# Altium schematic sheet Sheet1.SchDoc
size A4
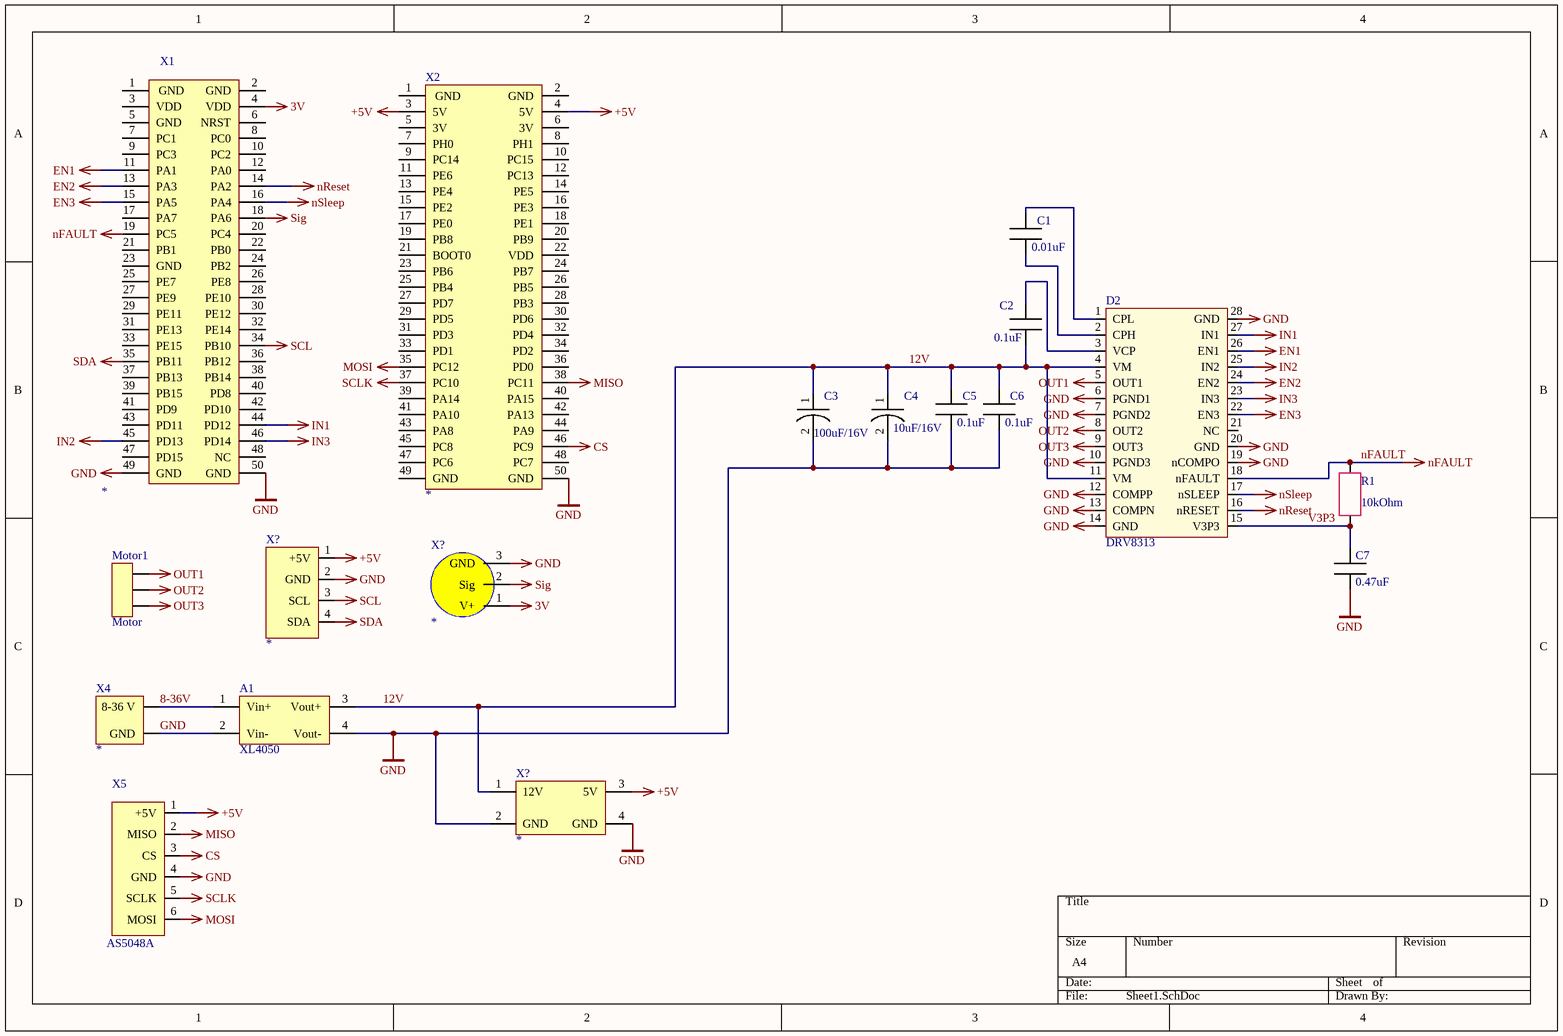
[diagram p0: Sheet1.SchDoc]

## Parts
(Parts that share a designator on the sheet are numbered #1, #2 ... from top to bottom, then left to right.)
A1  XL4050  [XL4050_PCB]
C1  0.01uF  [Ceramic 1206 - duplicate]
C2  0.1uF  [Ceramic 1206 - duplicate]
C3  100uF/16V  [CAP 50-35 5х11]
C4  10uF/16V  [CAP 50-35 5х11]
C5  0.1uF  [Ceramic 1206 - duplicate]
C6  0.1uF  [Ceramic 1206 - duplicate]
C7  0.47uF  [Ceramic 1206 - duplicate]
D2  DRV8313  [DRV8313 board]
Motor1  Motor  [Fhase out]
R1  10kOhm  [Resistor 1206]
X1  *  [STM32F4Discovery_P]
X2  *  [STM32F4Discovery_P]
X4  *  [Power input]
X5  AS5048A  [AS5048A_input]
X?#1  *  [Potentiometr]
X?#2  *  [I2C input]
X?#3  *  [LM2596S_PCB]

## Nets
3V: X1.4(VDD) X?#1.1(V+)
+5V: X2.3(5V) X2.4(5V) X5.1(+5V) X?#2.1(+5V) X?#3.3(5V)
CS: X2.46(PC9) X5.3(CS)
EN1: D2.26(EN1) X1.11(PA1)
EN2: D2.24(EN2) X1.13(PA3)
EN3: D2.22(EN3) X1.15(PA5)
GND: A1.2(Vin-) A1.4(Vout-) C3.2(-) C4.2(-) C5.2 C6.2 C7.2 D2.6(PGND1) D2.7(PGND2) D2.10(PGND3) D2.12(COMPP) D2.13(COMPN) D2.14(GND) D2.19(nCOMPO) D2.20(GND) D2.28(GND) X1.49(GND) X1.50(GND) X2.50(GND) X4.2(GND) X5.4(GND) X?#1.3(GND) X?#2.2(GND) X?#3.2(GND) X?#3.4(GND)
IN1: D2.27(IN1) X1.44(PD12)
IN2: D2.25(IN2) X1.45(PD13)
IN3: D2.23(IN3) X1.46(PD14)
MISO: X2.38(PC11) X5.2(MISO)
MOSI: X2.35(PC12) X5.6(MOSI)
nFAULT: D2.18(nFAULT) R1.2 X1.19(PC5)
nReset: D2.16(nRESET) X1.14(PA2)
nSleep: D2.17(nSLEEP) X1.16(PA4)
OUT1: D2.5(OUT1) Motor1.1
OUT2: D2.8(OUT2) Motor1.2
OUT3: D2.9(OUT3) Motor1.3
SCL: X1.34(PB10) X?#2.3(SCL)
SCLK: X2.37(PC10) X5.5(SCLK)
SDA: X1.35(PB11) X?#2.4(SDA)
Sig: X1.18(PA6) X?#1.2(Sig)
8-36V: A1.1(Vin+) X4.1(8-36_V)
12V: A1.3(Vout+) C2.2 C3.1(+) C4.1(+) C5.1 C6.1 D2.4(VM) D2.11(VM) X?#3.1(12V)
V3P3: C7.1 D2.15(V3P3) R1.1
NetC1_1: C1.1 D2.1(CPL)
NetC1_2: C1.2 D2.2(CPH)
NetC2_1: C2.1 D2.3(VCP)

Not connected (* = marked no-connect by the designer): D2 21(NC); X1 1(GND) 2(GND) 3(VDD) 5(GND) 6(NRST) 7(PC1) 8(PC0) 9(PC3) 10(PC2) 12(PA0) 17(PA7) 20(PC4) 21(PB1) 22(PB0) 23(GND) 24(PB2) 25(PE7) 26(PE8) 27(PE9) 28(PE10) 29(PE11) 30(PE12) 31(PE13) 32(PE14) 33(PE15) 36(PB12) 37(PB13) 38(PB14) 39(PB15) 40(PD8) 41(PD9) 42(PD10) 43(PD11) 47(PD15) 48(NC); X2 1(GND) 2(GND) 5(3V) 6(3V) 7(PH0) 8(PH1) 9(PC14) 10(PC15) 11(PE6) 12(PC13) 13(PE4) 14(PE5) 15(PE2) 16(PE3) 17(PE0) 18(PE1) 19(PB8) 20(PB9) 21(BOOT0) 22(VDD) 23(PB6) 24(PB7) 25(PB4) 26(PB5) 27(PD7) 28(PB3) 29(PD5) 30(PD6) 31(PD3) 32(PD4) 33(PD1) 34(PD2) 36(PD0) 39(PA14) 40(PA15) 41(PA10) 42(PA13) 43(PA8) 44(PA9) 45(PC8) 47(PC6) 48(PC7) 49(GND)

## Library data of the parts
A1 = XL4050_PCB
C1 C2 C5-C7 = Ceramic capacitor 1206
C3 = Elecrolite, К50-35, 100uF/16V
C4 = Electrolite, K50-35, 10uF/63V
Motor1 = Fhase out
R1 = Resistor
X1 = STM32F4_Discovery_P1
X2 = STM32F4_Discovery_P2
X4 = Power input
X5 = AS5048A_PCB
X?#1 = Potentiometr
X?#2 = I2C input
X?#3 = LM2596S_PCB